# EAGLE design TimeSeedsControls (EAGLE 9.6.2)
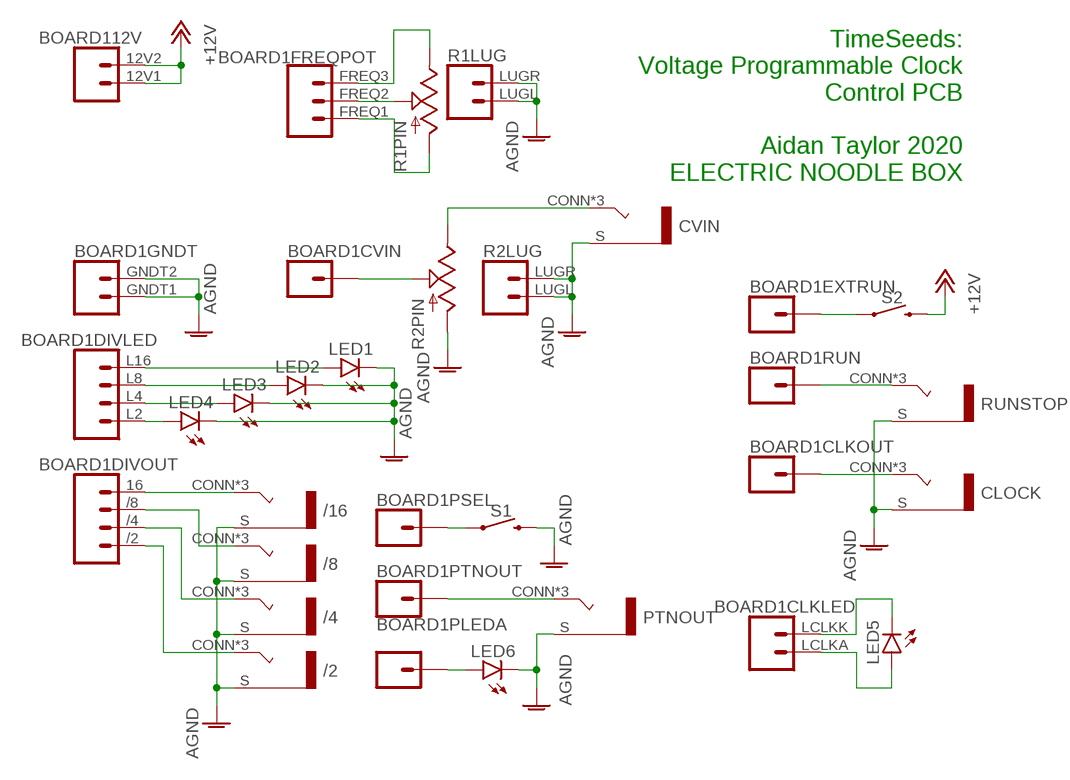
[diagram p0: schematic, sheet 1]

## Parts
/2  COMBI-JACKCINCHNANA  [NEWCOMBOJACK_PANEL]
/4  COMBI-JACKCINCHNANA  [NEWCOMBOJACK_PANEL]
/8  COMBI-JACKCINCHNANA  [NEWCOMBOJACK_PANEL]
/16  COMBI-JACKCINCHNANA  [NEWCOMBOJACK_PANEL]
BOARD1  TS-VPC_LINK  [TS-VPC]
CLOCK  COMBI-JACKCINCHNANA  [NEWCOMBOJACK_PANEL]
CVIN  COMBI-JACKCINCHNANA  [NEWCOMBOJACK_PANEL]
LED1  LED3MM  [LED3MM]
LED2  LED3MM  [LED3MM]
LED3  LED3MM  [LED3MM]
LED4  LED3MM  [LED3MM]
LED5  LED3MM  [LED3MM]
LED6  LED3MM  [LED3MM]
PTNOUT  COMBI-JACKCINCHNANA  [NEWCOMBOJACK_PANEL]
R1  POTENTIOMETER  [ALPHA_RV09_9MMPOT]
R2  POTENTIOMETER  [ALPHA_RV09_9MMPOT]
RUNSTOP  COMBI-JACKCINCHNANA  [NEWCOMBOJACK_PANEL]
S1  MCDTS-2_PUSHBUTTON  [MCDTS-2_PUSHBUTTON]
S2  MCDTS-2_PUSHBUTTON  [MCDTS-2_PUSHBUTTON]

## Nets
+12V: BOARD1.12V1 BOARD1.12V2 S2.P$3 S2.P$4
AGND: /2.S /4.S /8.S /16.S BOARD1.GNDT1 BOARD1.GNDT2 CLOCK.S CVIN.S LED1.K(C) LED2.K(C) LED3.K(C) LED4.K(C) LED6.K(C) PTNOUT.S R1.LUGL R1.LUGR R2.C1(PIN:A) R2.LUGL R2.LUGR RUNSTOP.S S1.P$3 S1.P$4
N$1: BOARD1.L2 LED4.A
N$2: BOARD1.L4 LED3.A
N$3: BOARD1.L8 LED2.A
N$4: BOARD1.L16 LED1.A
N$5: /16.CONN(T) /16.T1(T) /16.T2(T) BOARD1.16
N$6: /8.CONN(T) /8.T1(T) /8.T2(T) BOARD1./8
N$7: /4.CONN(T) /4.T1(T) /4.T2(T) BOARD1./4
N$8: /2.CONN(T) /2.T1(T) /2.T2(T) BOARD1./2
N$9: BOARD1.CLK CLOCK.CONN(T) CLOCK.T1(T) CLOCK.T2(T)
N$10: BOARD1.LCLKA LED5.A
N$11: BOARD1.LCLKK LED5.K(C)
N$12: BOARD1.FREQ2 R1.C2(PIN:W)
N$13: BOARD1.FREQ1 R1.C1(PIN:A)
N$14: BOARD1.CVIN R2.C2(PIN:W)
N$15: BOARD1.FREQ3 R1.C3(PIN:B)
N$16: CVIN.CONN(T) CVIN.T1(T) CVIN.T2(T) R2.C3(PIN:B)
N$17: BOARD1.PTRNOUT PTNOUT.CONN(T) PTNOUT.T1(T) PTNOUT.T2(T)
N$18: BOARD1.PLEDA LED6.A
N$19: BOARD1.PSEL S1.P$1 S1.P$2
N$20: BOARD1.EXTRUN S2.P$1 S2.P$2
N$21: BOARD1.RUN RUNSTOP.CONN(T) RUNSTOP.T1(T) RUNSTOP.T2(T)

## Notes on the sheet
- TimeSeeds:
  Voltage Programmable Clock
  Control PCB
  
  Aidan Taylor 2020
  ELECTRIC NOODLE BOX

## Library data of the parts
/2 /4 /8 /16 CLOCK CVIN PTNOUT RUNSTOP = ElectricNoodleBox:COMBI-JACK
BOARD1 = ElectricNoodleBox:TS-VPC_LINK
LED1-LED6 = led:LED: LED OSRAM: - CHIPLED LG R971, LG N971, LY N971, LG Q971, LY Q971, LO R971, LY R971 LH N974, LH R974 LS Q976, LO Q976, LY Q976 LO Q996 - Hyper CHIPLED LW Q18S LB Q993, LB Q99A, LB R99A - SideLED LS A670, LO A670, LY A670, LG A670, LP A670 LB A673, LV A673, LT A673, LW A673 LH A674 LY A675 LS A676, LA A676, LO A676, LY A676, LW A676 LS A679, LY A679, LG A679 - Hyper Micro SIDELED® LS Y876, LA Y876, LO Y876, LY Y876 LT Y87S - SmartLED LW L88C, LW L88S LB L89C, LB L89S, LG L890 LS L89K, LO L89K, LY L89K LS L896, LA L896, LO L896, LY L896 - TOPLED LS T670, LO T670, LY T670, LG T670, LP T670 LSG T670, LSP T670, LSY T670, LOP T670, LYG T670 LG T671, LOG T671, LSG T671 LB T673, LV T673, LT T673, LW T673 LH T674 LS T676, LA T676, LO T676, LY T676, LB T676, LH T676, LSB T676, LW T676 LB T67C, LV T67C, LT T67C, LS T67K, LO T67K, LY T67K, LW E67C LS E67B, LA E67B, LO E67B, LY E67B, LB E67C, LV E67C, LT E67C LW T67C LS T679, LY T679, LG T679 LS T770, LO T770, LY T770, LG T770, LP T770 LB T773, LV T773, LT T773, LW T773 LH T774 LS E675, LA E675, LY E675, LS T675 LS T776, LA T776, LO T776, LY T776, LB T776 LHGB T686 LT T68C, LB T68C - Hyper Mini TOPLED® LB M676 - Mini TOPLED Santana® LG M470 LS M47K, LO M47K, LY M47K Source: http://www.osram.convergy.de LUXEON: - LUMILED® LXK2-PW12-R00, LXK2-PW12-S00, LXK2-PW14-U00, LXK2-PW14-V00 LXK2-PM12-R00, LXK2-PM12-S00, LXK2-PM14-U00 LXK2-PE12-Q00, LXK2-PE12-R00, LXK2-PE12-S00, LXK2-PE14-T00, LXK2-PE14-U00 LXK2-PB12-K00, LXK2-PB12-L00, LXK2-PB12-M00, LXK2-PB14-N00, LXK2-PB14-P00, LXK2-PB14-Q00 LXK2-PR12-L00, LXK2-PR12-M00, LXK2-PR14-Q00, LXK2-PR14-R00 LXK2-PD12-Q00, LXK2-PD12-R00, LXK2-PD12-S00 LXK2-PH12-R00, LXK2-PH12-S00 LXK2-PL12-P00, LXK2-PL12-Q00, LXK2-PL12-R00 Source: www.luxeon.com KINGBRIGHT: KA-3528ASYC Source: www.kingbright.com
R1 R2 = ElectricNoodleBox:POTENTIOMETER
S1 S2 = ElectricNoodleBox:MCDTS-2_PUSHBUTTON

## Board
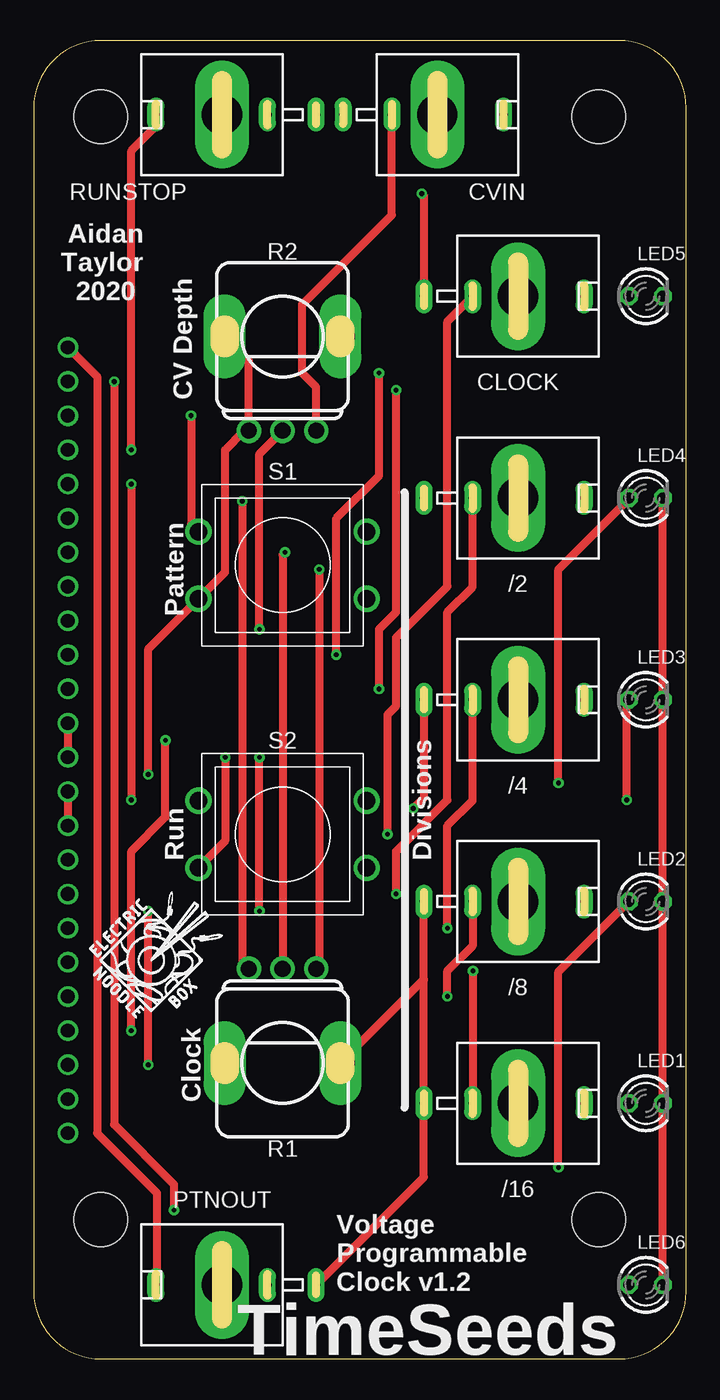
[diagram p1: board, top side]
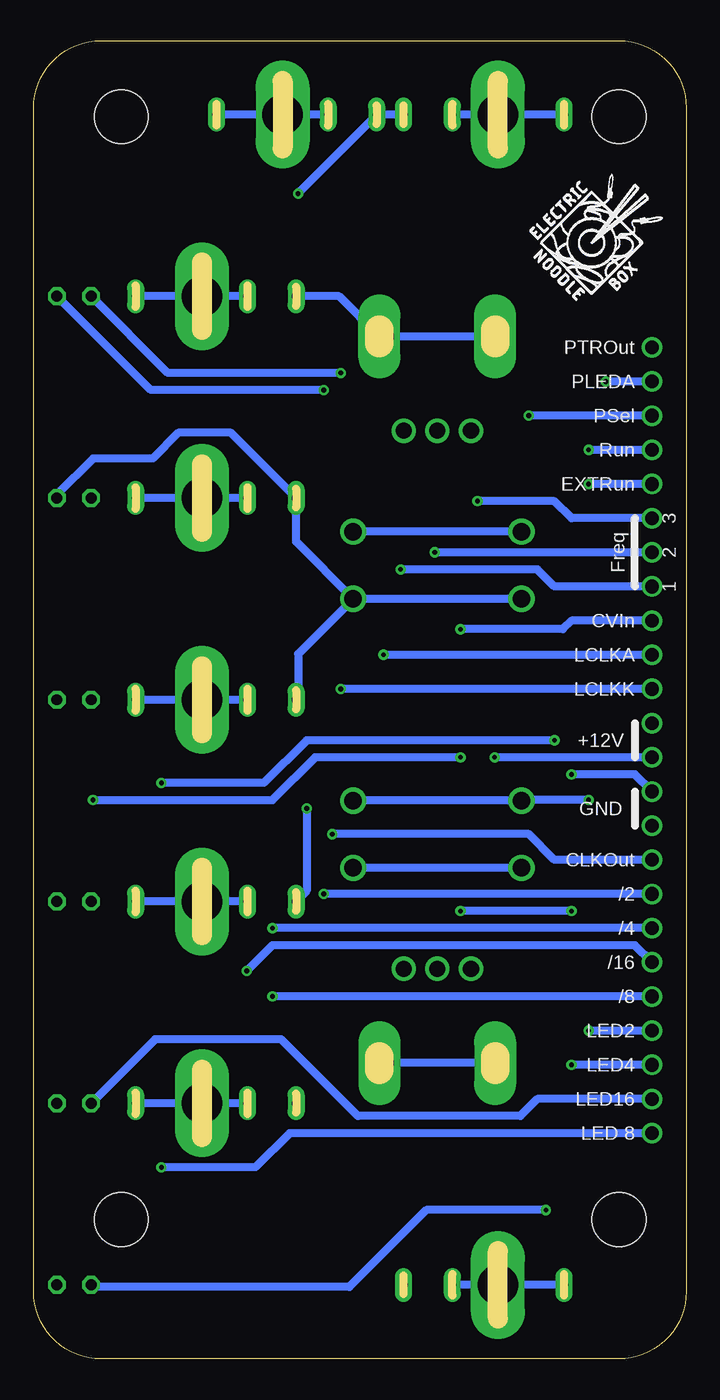
[diagram p2: board, bottom side, seen from below]

Size 48.5 x 98 mm. Coordinates in mm from the lower left corner, seen from the top.
Outline: 0,93 0,5 arc90 5,0 43.5,0 arc90 48.5,5 48.5,93 arc90 43.5,98 5,98 arc90 0,93
Copper layers (1*16): Top 0.035mm / dielectric 1.5mm / Bottom 0.035mm
Design rules "default": minimum track width 6mil, minimum drill 0.35mm, track to track 6mil, track to pad 6mil, pad to pad 6mil, via to via 6mil, smd to smd 6mil, copper to edge 40mil, drill to drill 6mil, minimum pad ring 10mil, minimum via ring 8mil, stop-mask expansion 4mil, vias tented up to drill 0mil, thermal gap 10mil

### Footprints (pad centres in the part's own frame; a part is rotated, then mirrored left to right if it is on the bottom)
NEWCOMBOJACK_PANEL = drill 3 pad 3.6 long: CONN 0,0 | drill 0.6 pad 1.27 long: S 0,-7; T1 0,4.92; T2 0,-3.38
TS-VPC = drill 1.016: 12V1 39.37,2.54; 12V2 41.91,2.54; 16 24.13,2.54; /2 29.21,2.54; /4 26.67,2.54; /8 21.59,2.54; CLK 31.75,2.54; CVIN 49.53,2.54; EXTRUN 59.69,2.54; FREQ1 52.07,2.54; FREQ2 54.61,2.54; FREQ3 57.15,2.54; GNDT1 34.29,2.54; GNDT2 36.83,2.54; L2 19.05,2.54; L4 16.51,2.54; L8 11.43,2.54; L16 13.97,2.54; LCLKA 46.99,2.54; LCLKK 44.45,2.54; PLEDA 67.31,2.54; PSEL 64.77,2.54; PTRNOUT 69.85,2.54; RUN 62.23,2.54 | hole 4: 5,5; 5,42; 87,5; 87,42
LED3MM = drill 0.813 octagon: A -1.27,0; K 1.27,0
ALPHA_RV09_9MMPOT = drill 1.2 pad 1.778: C1 -2.5,-7; C2 0,-7; C3 2.5,-7 | drill 2.1 pad 2.8 long: LUGL -4.3,0; LUGR 4.3,0
MCDTS-2_PUSHBUTTON = drill 1.3: P$1 -6.25,-2.5; P$2 6.25,-2.5; P$3 -6.25,2.5; P$4 6.25,2.5

### Placement (x,y rotation side)
/2  36,64 270 top
/4  36,49 270 top
/8  36,34 270 top
/16  36,19 270 top
BOARD1  0,5.35 90 bottom
CLOCK  36,79 270 top
CVIN  30,92.5 270 top
LED1  45.5,19 0 top
LED2  45.5,34 0 top
LED3  45.5,49 0 top
LED4  45.5,64 0 top
LED5  45.5,79 0 top
LED6  45.5,5.5 0 top
PTNOUT  14,5.5 90 top
R1  18.5,22 180 top
R2  18.5,76 0 top
RUNSTOP  14,92.5 90 top
S1  18.5,59 180 top
S2  18.5,39 180 top
U$1  [LOGO10X10]  4.08,25.04 0 top
U$2  [LOGO10X10]  11.7,78.38 0 bottom

### Tracks (layer width: path | path; a pad name or v marks a point on that pad's centre or on a via)
+12V  (via drill 0.35)
  Top 0.61: BOARD1.12V2 BOARD1.12V1 | S2.P$4 14.24,38.49 v14.24,44.72
  Bottom 0.61: BOARD1.12V1 v14.24,44.72 | S2.P$4 S2.P$3
AGND  (via drill 0.35)
  Top 0.61: BOARD1.GNDT2 BOARD1.GNDT1 | v8.53,43.45 8.53,52.77 S1.P$4 14.24,58.49 14.24,67.58 15.66,69 R2.C1 16,74.2 R2.LUGL | v28.84,86.63 29,86.47 CLOCK.S | /4.S 29,41.7 v28.21,40.91 | R1.LUGL 29,28.2 | 29,28.2 /8.S | PTNOUT.S 29,13.5 /16.S 29,28.2 | LED6.K LED1.K LED2.K LED3.K LED4.K
  Bottom 0.61: BOARD1.GNDT2 3.81,43.45 v8.53,43.45 | R1.LUGR R1.LUGL | S1.P$4 S1.P$3 | R2.LUGL R2.LUGR 25.8,79 CLOCK.S | RUNSTOP.S CVIN.S 28.84,86.66 v28.84,86.63 | S1.P$3 29,60.75 /2.S 33.85,68.85 37.73,68.85 39.64,66.94 44.09,66.94 46.77,64.26 LED4.K | S1.P$3 28.84,52.41 28.84,49.16 /4.S | v28.21,40.91 28.21,34.79 /8.S
N$1  (via drill 0.35)
  Top 0.61: v7.26,24.4 7.26,37.73 9.79,40.27 v9.79,45.99 | LED4.A 44.23,63.92 39.01,58.69 v39.01,42.81
  Bottom 0.61: BOARD1.L2 v7.26,24.4 | v39.01,42.81 31.38,42.81 28.21,45.99 v9.79,45.99
N$2  (via drill 0.35)
  Top 0.61: v8.53,21.86 v8.53,33.29 | v16.78,33.29 v16.78,44.72 | v44.09,41.55 44.09,48.85 LED3.A
  Bottom 0.61: BOARD1.L4 v8.53,21.86 | v8.53,33.29 v16.78,33.29 | v16.78,44.72 27.57,44.72 30.75,41.55 v44.09,41.55
N$3  (via drill 0.35)
  Top 0.61: LED2.A 39.01,28.77 v39.01,14.24
  Bottom 0.61: BOARD1.L8 29.48,16.78 32.02,14.24 v39.01,14.24
N$4
  Bottom 0.61: BOARD1.L16 11.06,19.32 12.34,18.05 24.4,18.05 30.11,23.77 39.47,23.77 LED1.A
N$5  (via drill 0.35)
  Top 0.61: v32.66,28.84 32.62,28.81 /16.T2
  Bottom 0.61: BOARD1.16 3.81,30.75 30.75,30.75 v32.66,28.84 | /16.T2 /16.CONN /16.T1
N$6  (via drill 0.35)
  Top 0.61: /8.T2 32.66,33.97 32.66,30.75 30.75,28.84 v30.75,26.94
  Bottom 0.61: BOARD1./8 v30.75,26.94 | /8.T2 /8.CONN /8.T1
N$7  (via drill 0.35)
  Top 0.61: v30.75,32.02 30.75,39.64 32.62,41.51 /4.T2
  Bottom 0.61: BOARD1./4 v30.75,32.02 | /4.T2 /4.CONN /4.T1
N$8  (via drill 0.35)
  Top 0.61: v26.94,34.56 26.94,37.73 30.75,41.55 30.75,55.52 32.62,57.38 /2.T2
  Bottom 0.61: BOARD1./2 v26.94,34.56 | /2.T2 /2.CONN /2.T1
N$9  (via drill 0.35)
  Top 0.61: v26.3,39.01 26.3,47.9 26.94,48.53 26.94,53.61 30.75,57.42 30.75,77.13 CLOCK.T2
  Bottom 0.61: BOARD1.CLK 9.79,37.1 11.7,39.01 v26.3,39.01 | CLOCK.T2 CLOCK.CONN CLOCK.T1
N$10  (via drill 0.35)
  Top 0.61: v22.5,52.34 22.5,62.5 25.67,65.67 v25.67,73.3
  Bottom 0.61: BOARD1.LCLKA v22.5,52.34 | LED5.A 38.52,73.3 v25.67,73.3
N$11  (via drill 0.35)
  Top 0.61: v25.67,49.8 25.67,54.24 26.94,55.52 v26.94,72.03
  Bottom 0.61: BOARD1.LCLKK v25.67,49.8 | v26.94,72.03 39.8,72.03 LED5.K
N$12  (via drill 0.35)
  Top 0.61: v18.68,59.96 18.5,59.77 R1.C2
  Bottom 0.61: BOARD1.FREQ2 v18.68,59.96
N$13  (via drill 0.35)
  Top 0.61: v21.23,58.69 21.23,29.23 R1.C1
  Bottom 0.61: BOARD1.FREQ1 9.79,57.42 11.06,58.69 v21.23,58.69
N$14  (via drill 0.35)
  Top 0.61: v16.78,54.24 16.78,67.28 R2.C2
  Bottom 0.61: BOARD1.CVIN 8.53,54.88 9.16,54.24 v16.78,54.24
N$15  (via drill 0.35)
  Top 0.61: v15.51,63.77 15.51,29.49 R1.C3
  Bottom 0.61: BOARD1.FREQ3 8.53,62.5 9.79,63.77 v15.51,63.77
N$16
  Top 0.61: R2.C3 21,72.25 19.95,73.3 19.95,78.38 26.62,85.04 CVIN.T2
  Bottom 0.61: CVIN.T2 CVIN.CONN CVIN.T1
N$17
  Top 0.61: BOARD1.PTRNOUT 4.71,73.03 4.71,16.78 9.16,12.34 9.16,5.58 PTNOUT.T1
  Bottom 0.61: PTNOUT.T1 PTNOUT.CONN PTNOUT.T2
N$18  (via drill 0.35)
  Top 0.61: v5.99,72.66 5.99,17.41 10.43,12.97 v10.43,11.06
  Bottom 0.61: BOARD1.PLEDA v5.99,72.66 | v10.43,11.06 19.32,11.06 25.04,5.35 44.08,5.35 LED6.A
N$19  (via drill 0.35)
  Top 0.61: S1.P$2 11.7,62.05 v11.7,70.12
  Bottom 0.61: BOARD1.PSEL v11.7,70.12 | S1.P$2 S1.P$1
N$20  (via drill 0.35)
  Top 0.61: v7.26,65.04 v7.26,41.55
  Bottom 0.61: BOARD1.EXTRUN v7.26,65.04 | v7.26,41.55 12.21,41.55 S2.P$2 S2.P$1
N$21  (via drill 0.35)
  Top 0.61: v7.26,67.58 7.26,89.81 9.16,91.71 9.16,92.42 RUNSTOP.T1
  Bottom 0.61: BOARD1.RUN v7.26,67.58 | RUNSTOP.T1 RUNSTOP.CONN RUNSTOP.T2

### Text on the board
tPlace: Aidan / Taylor / 2020 | CV Depth | Pattern | Divisions | Run | Clock | Voltage / Programmable / Clock v1.2 | TimeSeeds